# EAGLE design MG2639 Cellular Shield (EAGLE 7.1.0)
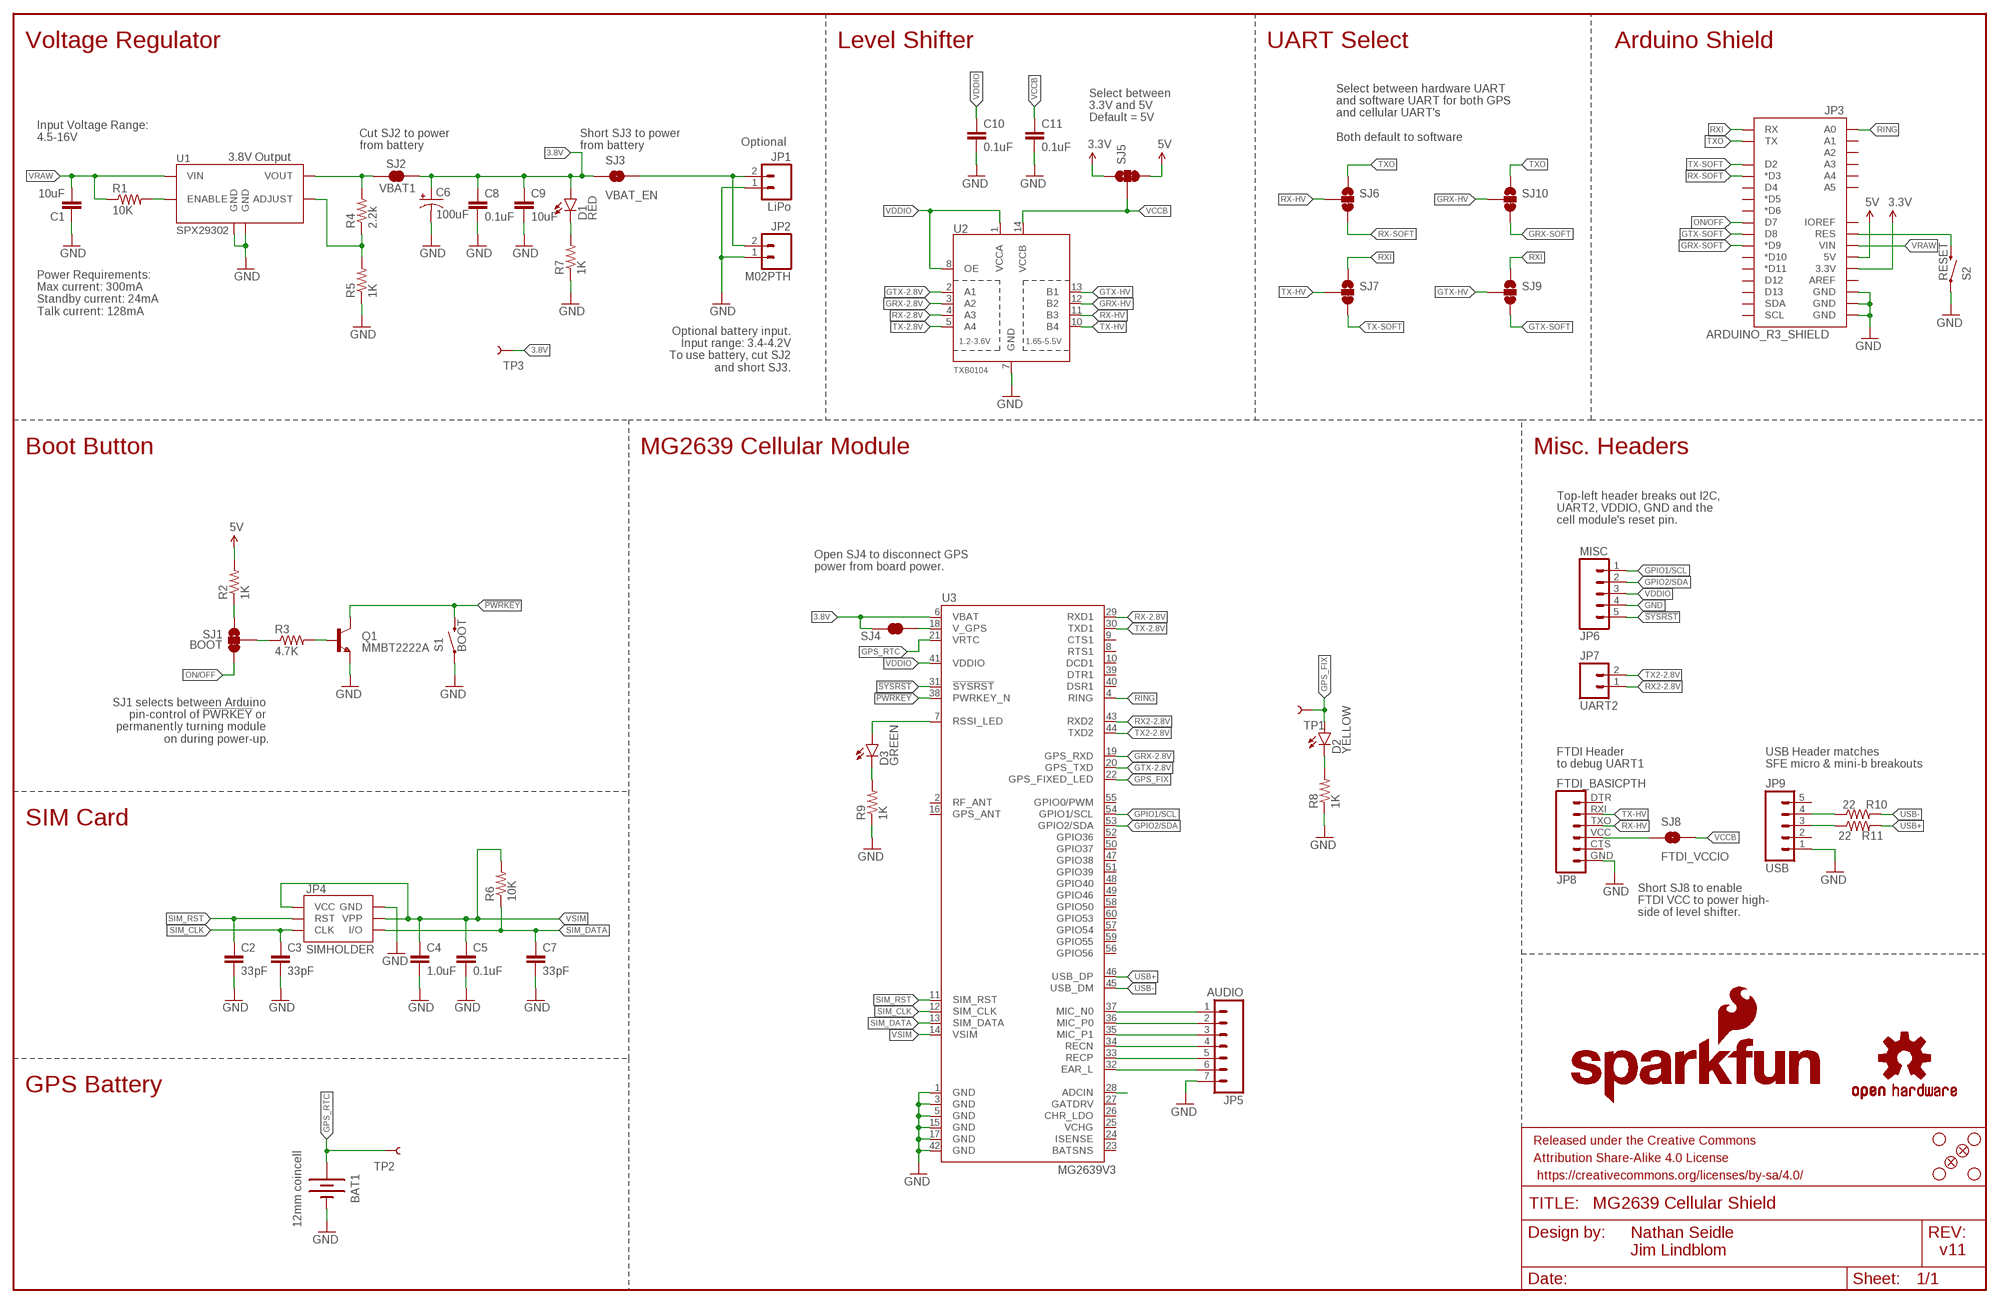
[diagram p0: schematic, sheet 1]

## Parts
BAT1  12mm coincell  BATTERY12MM  [BATTCON_12MM]
C1  10uF  10UF50V20%(1210)  [1210]
C2  33pF  33PF-50V-5%-(0603)  [0603-CAP]
C3  33pF  33PF-50V-5%-(0603)  [0603-CAP]
C4  1.0uF  1.0UF-16V-10%(0603)  [0603-CAP]
C5  0.1uF  0.1UF-25V(+80/-20%)(0603)  [0603-CAP]
C6  100uF  100UF-10V-10%(TANT)  [EIA7343]
C7  33pF  33PF-50V-5%-(0603)  [0603-CAP]
C8  0.1uF  0.1UF-25V(+80/-20%)(0603)  [0603-CAP]
C9  10uF  10UF50V20%(1210)  [1210]
C10  0.1uF  0.1UF-25V(+80/-20%)(0603)  [0603-CAP]
C11  0.1uF  0.1UF-25V(+80/-20%)(0603)  [0603-CAP]
D1  RED  LED-RED1206  [LED-1206]
D2  YELLOW  LED-YELLOWLARGE  [LED-1206]
D3  GREEN  LED-GREENLARGE  [LED-1206]
FID1  FIDUCIAL1X2  [FIDUCIAL-1X2]
FID2  FIDUCIAL1X2  [FIDUCIAL-1X2]
FRAME1  FRAME-LEDGER  [CREATIVE_COMMONS]
JP1  LiPo  M02JST-PTH-2  [JST-2-PTH]
JP2  M02PTH  [1X02]
JP3  ARDUINO_R3_SHIELD  ARDUINO_R3_SHIELDNOLABELS  [UNO_R3_SHIELD_NOLABELS]
JP4  SIMHOLDER  SIMHOLDERSIM  [SIMHOLDER]
JP5  AUDIO  M07  [1X07]
JP6  MISC  M05PTH  [1X05]
JP7  UART2  M02PTH  [1X02]
JP8  FTDI_BASICPTH  [FTDI_BASIC]
JP9  USB  M05PTH  [1X05]
LOGO1  SFE_LOGO_NAME.1_INCH  [SFE_LOGO_NAME_.1]
LOGO2  SFE_LOGO_NAME_FLAME.2_INCH  [SFE_LOGO_NAME_FLAME_.2]
LOGO3  OSHW-LOGOS  [OSHW-LOGO-S]
Q1  MMBT2222A  TRANSISTOR_NPNMMBT2222A  [SOT23-3]
R1  10K  10KOHM1/10W1%(0603)0603  [0603-RES]
R2  1K  1KOHM1/10W1%(0603)  [0603-RES]
R3  4.7K  4.7KOHM1/10W1%(0603)  [0603]
R4  2.2k  2.2KOHM1/10W1%(0603)  [0603-RES]
R5  1K  1KOHM1/10W1%(0603)  [0603-RES]
R6  10K  10KOHM1/10W1%(0603)0603  [0603-RES]
R7  1K  1KOHM1/10W1%(0603)  [0603-RES]
R8  1K  1KOHM1/10W1%(0603)  [0603-RES]
R9  1K  1KOHM1/10W1%(0603)  [0603-RES]
R10  22  22OHM1/10W1%(0603)  [0603-RES]
R11  22  22OHM1/10W1%(0603)  [0603-RES]
S1  BOOT  SWITCH-MOMENTARY-2SMD  [TACTILE-SWITCH-SMD]
S2  RESET  SWITCH-MOMENTARY-2SMD  [TACTILE-SWITCH-SMD]
SJ1  BOOT  JUMPER-PAD-3-2OF3_NC_BY_TRACE  [PAD-JUMPER-3-2OF3_NC_BY_TRACE_YES_SILK_FULL_BOX]
SJ2  VBAT1  JUMPER-PAD-2-NC_BY_TRACE  [PAD-JUMPER-2-NC_BY_TRACE_YES_SILK]
SJ3  VBAT_EN  JUMPER-PAD-2-NOYES_SILK  [PAD-JUMPER-2-NO_YES_SILK]
SJ4  JUMPER-PAD-2-NC_BY_TRACE  [PAD-JUMPER-2-NC_BY_TRACE_YES_SILK]
SJ5  JUMPER-PAD-3-2OF3_NC_BY_TRACE  [PAD-JUMPER-3-2OF3_NC_BY_TRACE_YES_SILK_FULL_BOX]
SJ6  JUMPER-PAD-3-2OF3_NC_BY_TRACE  [PAD-JUMPER-3-2OF3_NC_BY_TRACE_YES_SILK_FULL_BOX]
SJ7  JUMPER-PAD-3-2OF3_NC_BY_TRACE  [PAD-JUMPER-3-2OF3_NC_BY_TRACE_YES_SILK_FULL_BOX]
SJ8  FTDI_VCCIO  JUMPER-PAD-2-NOYES_SILK  [PAD-JUMPER-2-NO_YES_SILK]
SJ9  JUMPER-PAD-3-2OF3_NC_BY_TRACE  [PAD-JUMPER-3-2OF3_NC_BY_TRACE_YES_SILK_FULL_BOX]
SJ10  JUMPER-PAD-3-2OF3_NC_BY_TRACE  [PAD-JUMPER-3-2OF3_NC_BY_TRACE_YES_SILK_FULL_BOX]
STANDOFF1  STAND-OFF  [STAND-OFF]
STANDOFF2  STAND-OFF  [STAND-OFF]
STANDOFF3  STAND-OFF  [STAND-OFF]
STANDOFF4  STAND-OFF  [STAND-OFF]
TP1  TEST-POINT3X5  [PAD.03X.05]
TP2  TEST-POINT3X5  [PAD.03X.05]
TP3  TEST-POINT3X5  [PAD.03X.05]
U1  SPX29302  [Q5-DD_SPX29300]
U2  TXB0104  TXB0104PWRSOIC14  [SO14]
U3  MG2639V3  [MG2639]

## Nets
3.3V: JP3.3.3V SJ5.1
3.8V: C6.A(+) C8.1 C9.1 D1.A SJ2.2 SJ3.1 SJ4.1 TP3.P$1 U3.6(VBAT)
5V: JP3.5V R2.2 SJ5.3
!PWRKEY: Q1.3(C) S1.3 U3.38(PWRKEY_N)
!SYSRST: JP6.5 U3.31(!SYSRST)
ADCIN: U3.28(ADCIN)
ADJUST: R4.1 R5.2 U1.5(ADJUST)
EAR_L: JP5.6 U3.32(EAR_L)
GND: BAT1.GND(-) C1.1 C2.2 C3.2 C4.2 C5.2 C6.C(-) C7.2 C8.2 C9.2 C10.2 C11.2 JP1.1 JP2.1 JP3.GND@0(GND) JP3.GND@1(GND) JP3.GND@2(GND) JP4.C5(GND) JP5.7 JP6.4 JP8.GND JP9.1 Q1.2(E) R5.1 R7.1 R8.1 R9.1 S1.1 S2.1 U1.3(GND) U1.6(GND) U2.7(GND) U3.1(GND) U3.3(GND) U3.5(GND) U3.15(GND) U3.17(GND) U3.42(GND)
GPIO1/SCL: JP6.1 U3.54(GPIO1/SCL)
GPIO2/SDA: JP6.2 U3.53(GPIO2/SDA)
GPS_FIX: D2.A TP1.P$1 U3.22(GPS_FIXED_LED)
GPS_RTC: BAT1.PWR@1(+) TP2.P$1 U3.21(VRTC)
GRX-2.8V: U2.3(A2) U3.19(GPS_RXD)
GRX-HV: SJ10.2 U2.12(B2)
GRX-SOFT: JP3.D9(*D9) SJ10.3
GTX-2.8V: U2.2(A1) U3.20(GPS_TXD)
GTX-HV: SJ9.2 U2.13(B1)
GTX-SOFT: JP3.D8 SJ9.3
MIC_N0: JP5.1 U3.37(MIC_N0)
MIC_P0: JP5.2 U3.36(MIC_P0)
MIC_P1: JP5.3 U3.35(MIC_P1)
N$1: R1.2 U1.1(ENABLE)
N$2: JP9.4 R10.1
N$3: Q1.1(B) R3.2
N$4: R4.2 SJ2.1 U1.4(VOUT)
N$5: R3.1 SJ1.2
N$6: R2.1 SJ1.1
N$7: D3.A U3.7(RSSI_LED)
N$8: D3.C R9.2
N$9: D2.C R8.2
N$10: JP9.3 R11.1
N$11: JP8.VCC SJ8.1
N$12: JP1.2 JP2.2 SJ3.2
N$17: D1.C R7.2
ON/OFF: JP3.D7 SJ1.3
RECN: JP5.4 U3.34(RECN)
RECP: JP5.5 U3.33(RECP)
RESET: JP3.RES S2.3
RING: JP3.A0 U3.4(RING)
RX2-2.8V: JP7.1 U3.43(RXD2)
RX-2.8V: U2.4(A3) U3.29(RXD1)
RX-HV: JP8.TXO SJ6.2 U2.11(B3)
RX-SOFT: JP3.D3(*D3) SJ6.3
RXI: JP3.RX SJ7.1 SJ9.1
SIM_CLK: C3.1 JP4.C3(CLK) U3.12(SIM_CLK)
SIM_DATA: C7.1 JP4.C7(I/O) R6.1 U3.13(SIM_DATA)
SIM_RST: C2.1 JP4.C2(RST) U3.11(SIM_RST)
TX2-2.8V: JP7.2 U3.44(TXD2)
TX-2.8V: U2.5(A4) U3.30(TXD1)
TX-HV: JP8.RXI SJ7.2 U2.10(B4)
TX-SOFT: JP3.D2 SJ7.3
TXO: JP3.TX SJ6.1 SJ10.1
USB+: R11.2 U3.46(USB_DP)
USB-: R10.2 U3.45(USB_DM)
V_GPS: SJ4.2 U3.18(V_GPS)
VCCB: C11.1 SJ5.2 SJ8.2 U2.14(VCCB)
VDDIO: C10.1 JP6.3 U2.1(VCCA) U2.8(OE) U3.41(VDDIO)
VRAW: C1.2 JP3.VIN R1.1 U1.2(VIN)
VSIM: C4.1 C5.1 JP4.C1(VCC) JP4.C6(VPP) R6.2 U3.14(VSIM)
Unconnected: JP3.A1 JP3.A2 JP3.A3 JP3.A4 JP3.A5 JP3.AREF JP3.D4 JP3.D5(*D5) JP3.D6(*D6) JP3.D10(*D10) JP3.D11(*D11) JP3.D12 JP3.D13 JP3.IOREF JP3.SCL JP3.SDA JP8.CTS JP8.DTR JP9.2 JP9.5 U3.2(RF_ANT) U3.8(RTS1) U3.9(CTS1) U3.10(DCD1) U3.16(GPS_ANT) U3.23(BATSNS) U3.24(ISENSE) U3.26(CHR_LDO) U3.27(GATDRV) U3.39(DTR1) U3.40(DSR1) U3.47(GPIO38) U3.48(GPIO40) U3.49(GPIO46) U3.50(GPIO37) U3.51(GPIO39) U3.52(GPIO36) U3.55(GPIO0/PWM) U3.56(GPIO56) U3.57(GPIO54) U3.58(GPIO50) U3.59(GPIO55) U3.60(GPIO53)

## Notes on the sheet
- Voltage Regulator | Level Shifter | UART Select | Arduino Shield
- Select between
  3.3V and 5V
  Default = 5V
- Input Voltage Range:
  4.5-16V
- Select between hardware UART
  and software UART for both GPS
  and cellular UART's
  
  Both default to software
- Optional
- Cut SJ2 to power
  from battery
- Short SJ3 to power
  from battery
- 3.8V Output
- Power Requirements:
  Max current: 300mA
  Standby current: 24mA
  Talk current: 128mA
- Optional battery input.
  Input range: 3.4-4.2V
  To use battery, cut SJ2
  and short SJ3.
- Boot Button | MG2639 Cellular Module | Misc. Headers
- Top-left header breaks out I2C, 
  UART2, VDDIO, GND and the 
  cell module's reset pin.
- Open SJ4 to disconnect GPS 
  power from board power.
- SJ1 selects between Arduino 
  pin-control of !PWRKEY! or 
  permanently turning module 
  on during power-up.
- FTDI Header
  to debug UART1
- USB Header matches
  SFE micro & mini-b breakouts
- SIM Card
- Short SJ8 to enable 
  FTDI VCC to power high-
  side of level shifter.
- GPS Battery
- Nathan Seidle
  Jim Lindblom
- v11

## Power pins joined to a net without a drawn wire
VCHG: U3.25(VCHG)

## Library data of the parts
BAT1 = SparkFun-Electromechanical:BATTERY: Battery Holders Various common sizes : AA, AAA, 20mm coin cell and 12mm coin cell. 20MM_4LEGS, BATT-10373; PROD_ID: BATT-08044
C1 C9 = SparkFun-Capacitors:10UF50V20%(1210): CAP-09824; PROD_ID: CAP-09824
C2 C3 C7 = SparkFun-Capacitors:33PF-50V-5%-(0603): CAP-10142; PROD_ID: CAP-10142
C4 = SparkFun-Capacitors:1.0UF-16V-10%(0603): CAP-00868; PROD_ID: CAP-00868
C5 C8 C10 C11 = SparkFun-Capacitors:0.1UF-25V(+80/-20%)(0603): CAP-00810 Ceramic Standard decoupling cap; PROD_ID: CAP-00810
C6 = SparkFun-Capacitors:100UF-10V-10%(TANT): CAP-07890; PROD_ID: CAP-07890
D1 = SparkFun-LED:LED-RED: Assorted Red LEDs LilyPad 1206- DIO-09912 1206- DIO-00809 0603- DIO-00819; PROD_ID: DIO-00809
D2 = SparkFun-LED:LED-YELLOW: Yellow SMD LEDs LilyPad 1206- DIO-09909 0603- DIO-09003; PROD_ID: DIO-00820
D3 = SparkFun-LED:LED-GREEN: Various green LEDs Green LEDs used in SFE Production 0603- DIO-00821 LARGE- DIO-00862 LILYPAD- DIO-09910; PROD_ID: DIO-00862
FID1 FID2 = SparkFun-Aesthetics:FIDUCIAL: Fiducial Alignment Points Various fiducial points for machine vision alignment.
FRAME1 = SparkFun-Aesthetics:FRAME-LEDGER: Schematic Frame Standard 11x14 US Ledger frame
JP1 = SparkFun-Connectors:M02: Standard 2-pin 0.1" header. Use with - straight break away headers ( PRT-00116) - right angle break away headers (PRT-00553) - swiss pins (PRT-00743) - machine pins (PRT-00117) - female headers (PRT-00115) Molex polarized connector foot print use with: PRT-08233 with associated crimp pins and housings. 2.54_SCREWTERM for use with PRT-10571. 3.5mm Screw Terminal footprints for PRT-08084 5mm Screw Terminal footprints for use with PRT-08432; PROD_ID: CONN-09863; SKU: PRT-09914
JP2 JP7 = SparkFun-Connectors:M02: Standard 2-pin 0.1" header. Use with - straight break away headers ( PRT-00116) - right angle break away headers (PRT-00553) - swiss pins (PRT-00743) - machine pins (PRT-00117) - female headers (PRT-00115) Molex polarized connector foot print use with: PRT-08233 with associated crimp pins and housings. 2.54_SCREWTERM for use with PRT-10571. 3.5mm Screw Terminal footprints for PRT-08084 5mm Screw Terminal footprints for use with PRT-08432
JP3 = SparkFun-Boards:ARDUINO_R3_SHIELD: Shield form compatible with the Arduino Uno R3.
JP4 = SparkFun-Connectors:SIMHOLDER: SIM Socket Socket for SIM cellular cards. Schematic element and footprint production proven. Spark Fun Electronics SKU : PRT-00548; PROD_ID: CONN-08536
JP5 = SparkFun-Connectors:M07: Header 7 Standard 7-pin 0.1" header. Use with straight break away headers (SKU : PRT-00116), right angle break away headers (PRT-00553), swiss pins (PRT-00743), machine pins (PRT-00117), and female headers (PRT-00115). NOTES ON THE VARIANTS LOCK and LOCK_LONGPADS... This footprint was designed to help hold the alignment of a through-hole component (i.e. 7-pin header) while soldering it into place. You may notice that each hole has been shifted either up or down by 0.005 of an inch from it's more standard position (which is usually a perfectly straight line). This slight alteration caused the pins (the squares in the middle) to touch the edges of the holes. Because they are alternating, it causes a "brace" to hold the header in place. 0.005 has proven to be the perfect amount of "off-center" position when using our standard breakaway headers. Although looks a little odd when you look at the bare footprint, once you have a header in there, the alteration is very hard to notice. Also, if you push a header all the way into place, it is covered up entirely on the bottom side. This idea of altering the position of holes to aid alignment will be further integrated into the Sparkfun Library for other footprints. It can help hold any component with 3 or more connection pins.
JP6 JP9 = SparkFun-Connectors:M05: Header 5 Standard 5-pin 0.1" header. Use with straight break away headers (SKU : PRT-00116), right angle break away headers (PRT-00553), swiss pins (PRT-00743), machine pins (PRT-00117), and female headers (PRT-00115). Molex polarized connector foot print use with SKU : PRT-08230 with associated crimp pins and housings.
JP8 = SparkFun-Connectors:FTDI_BASIC: FTDI Basic header with labels
LOGO1 = SparkFun-Aesthetics:SFE_LOGO_NAME: SFE Logo, name only This is the SparkFun name logo. The logo on the schematic will always be the same size; the package variant is the height of the flame part of the logo (or the height the flame would be, if it were drawn). Default layer for the logo on the board is tSilk.
LOGO2 = SparkFun-Aesthetics:SFE_LOGO_NAME_FLAME: SFE Logo, name and flame This is the SparkFun full logo. The logo on the schematic will always be the same size; the package variant is the height of the flame part of the logo. Default layer for the logo on the board is tSilk.
LOGO3 = SparkFun-Aesthetics:OSHW-LOGO: Open Source Hardware Logo This logo indicates the piece of hardware it is found on incorporates a OSHW license and/or adheres to the definition of open source hardware found here: http://freedomdefined.org/OSHW
Q1 = SparkFun-DiscreteSemi:TRANSISTOR_NPN: Generic NPN BJT MMBT2222A - TRANS-08049 (SOT-23, 1A 40V) MPSA42 - TRANS-09116 (SOT-23, 500mA 300V) MMBT5088LT1G - TRANS-11160 (SOT-23, 50 mA 30V) BC547 - COM-08928 <http://www.sparkfun.com/products/8928> (TO-92 45V 100mA) (1.Collector 2.Base 3.Emitter) 2N3904 - COM-00521 <http://www.sparkfun.com/products/521> (TO-92 40V 200mA) (1.Emitter 2.Base 3.Collector) P2N2222A - COM-12852 <http://www.sparkfun.com/products/12852> (TO-92 40V 600mA) (1.Collector 2.Base 3.Emitter); PROD_ID: TRANS-08049
R1 R6 = SparkFun-Resistors:10KOHM1/10W1%(0603): RES-00824; PROD_ID: RES-00824
R2 R5 R7-R9 = SparkFun-Resistors:1KOHM1/10W1%(0603): RES-07856; PROD_ID: RES-07856
R3 = SparkFun-Resistors:4.7KOHM1/10W1%(0603): RES-07857; PROD_ID: RES-07857
R4 = SparkFun-Resistors:2.2KOHM1/10W1%(0603): RES-08272; PROD_ID: RES-08272
R10 R11 = SparkFun-Resistors:22OHM1/10W1%(0603): RES-08698; PROD_ID: RES-08698
S1 S2 = SparkFun-Electromechanical:SWITCH-MOMENTARY-2: Various NO switches- pushbuttons, reed, etc; PROD_ID: SWCH-08247
SJ1 SJ5-SJ7 SJ9 SJ10 = SparkFun-Passives:JUMPER-PAD-3-2OF3_NC_BY_TRACE
SJ2 SJ4 = SparkFun-Passives:JUMPER-PAD-2-NC_BY_TRACE
SJ3 SJ8 = SparkFun-Passives:JUMPER-PAD-2-NO
STANDOFF1-STANDOFF4 = SparkFun-Electromechanical:STAND-OFF: #4 Stand Off This is the mechanical footprint for a #4 phillips button head screw. Use the keepout ring to avoid running the screw head into surrounding components. SKU : PRT-00447
TP1-TP3 = SparkFun-Passives:TEST-POINT: Bare copper test points for troubleshooting or ICT
U1 = SparkFun-PowerIC:SPX29302: 3A LDO regulator; PROD_ID: VREG-08337
U2 = SparkFun-DigitalIC:TXB0104PWR: 4-Bit Bi-Directional Level Shifter 1.2V-3.6V (VCCA) to 1.65V-5.5V (VCCB) bi-directional level shifter with auto direction sensing. Max data rate - VCCA 1.8V: 20Mbps (50ns), VCCA 3.3V: 100Mbps (10ns) Digikey: 296-21929-1-ND (TSSOP) IC-11329; PROD_ID: IC-11329
U3 = MG2639:MG2639; PROD_ID: GPS-12331

## Net classes
0 default: width 0.203 mm
1 3.8V: width 0.305 mm

## Board
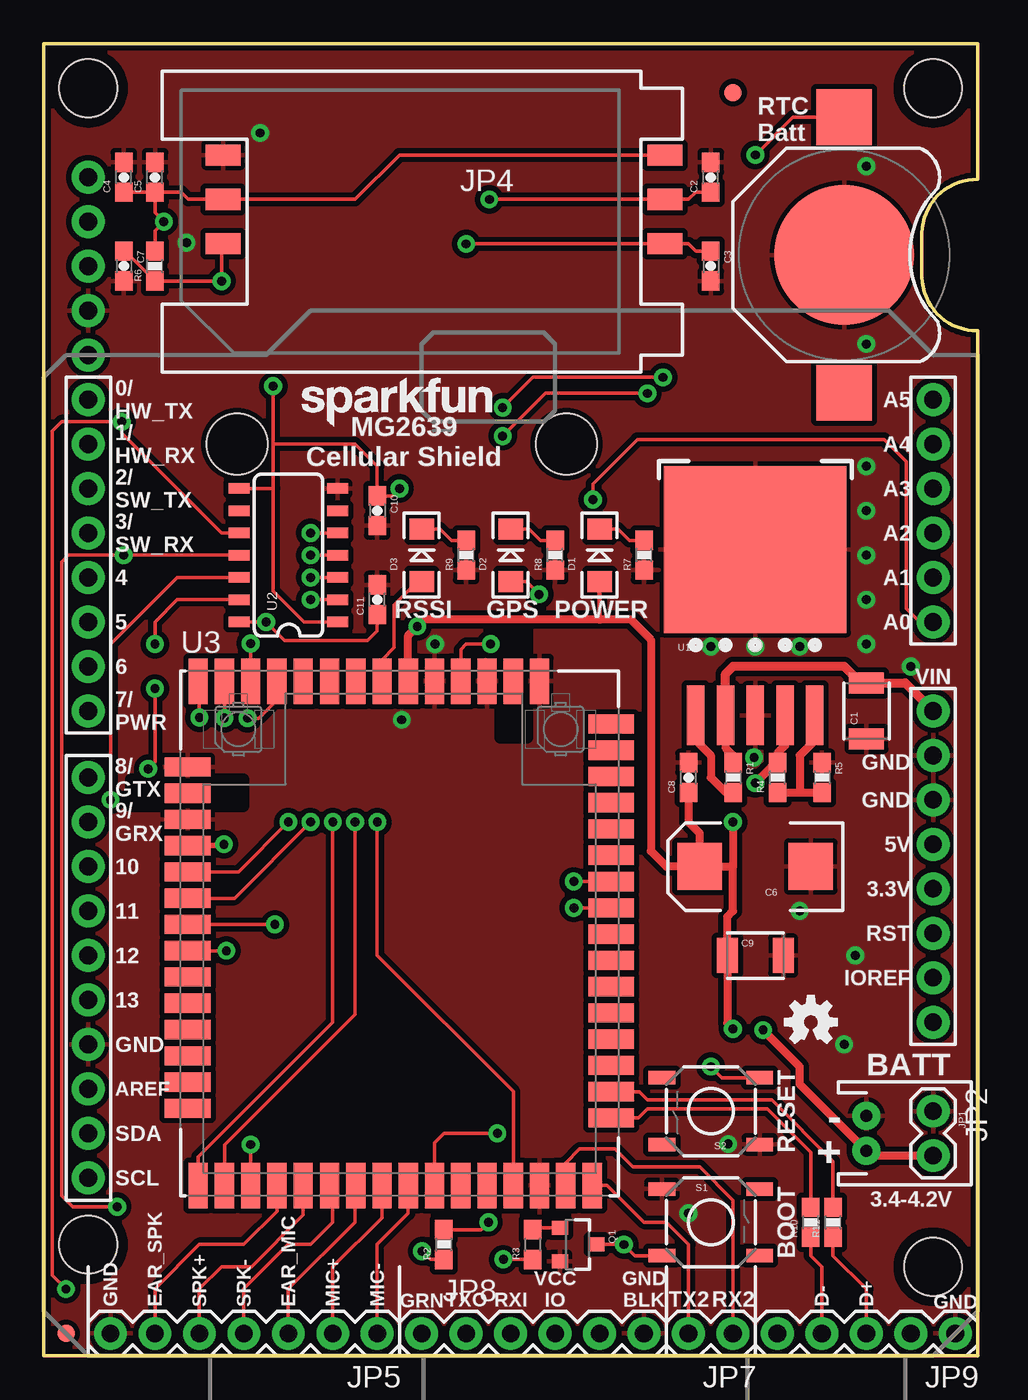
[diagram p1: board, top side]
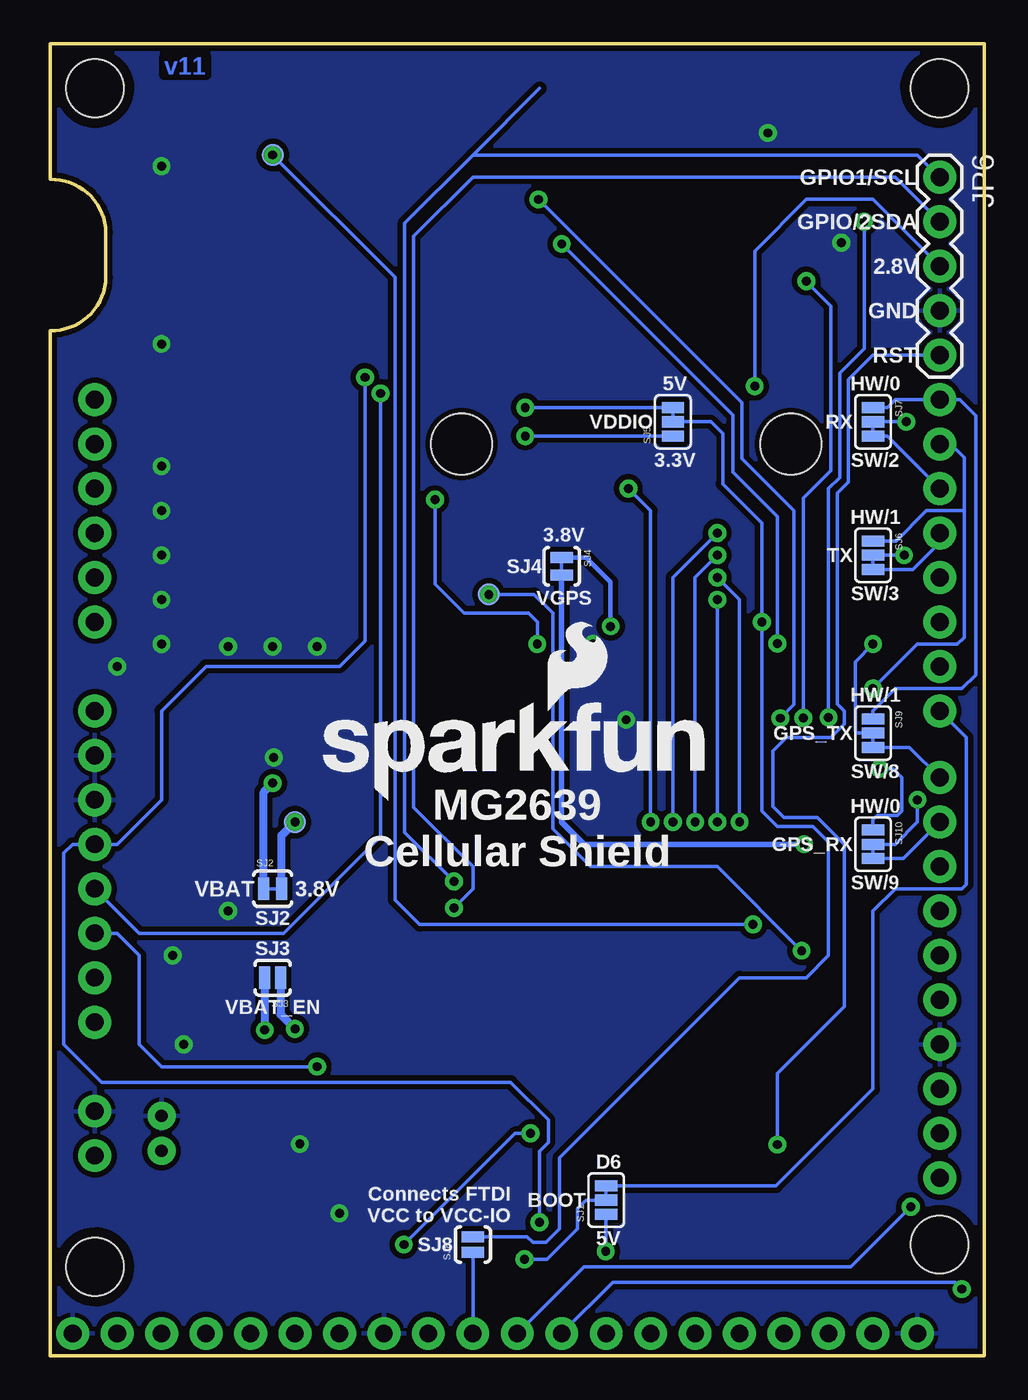
[diagram p2: board, bottom side, seen from below]

Size 53.34 x 74.93 mm. Coordinates in mm from the lower left corner, seen from the top.
Outline: 0,0 53.34,0 53.34,58.55 arc-90 50.16,61.59 50.16,64.14 arc-90 53.34,67.18 53.34,74.93 0,74.93 0,0
Copper layers (1*16): Top 0.035mm / dielectric 1.5mm / Bottom 0.035mm
Design rules "SparkFun-2-layer *": minimum track width 7mil, minimum drill 15mil, track to track 7mil, track to pad 7mil, pad to pad 7mil, via to via 7mil, smd to smd 7mil, copper to edge 8mil, drill to drill 8mil, minimum pad ring 12mil, minimum via ring 10mil, stop-mask expansion 4mil, vias tented up to drill 20mil, thermal gap 10mil
Holes 3.5 mm at 29.84,52.07 11.05,52.07
tRestrict: area 9.6,31.4 to 11.4,32.9; area 5,31.4 to 6.8,32.9; area 26.1,35.3 to 27.6,37.1; area 26.1,39.9 to 27.6,41.7

### Footprints (pad centres in the part's own frame; a part is rotated, then mirrored left to right if it is on the bottom)
BATTCON_12MM = smd 8 x 8: GND 0,0 | smd 3.175 x 3.175: PWR@1 -7.874,0; PWR@2 7.874,0
1210 = smd 1.2 x 2: 1 -1.6,0; 2 1.6,0
0603-CAP = smd 1.1 x 1: 1 -0.85,0; 2 0.85,0
EIA7343 = smd 2.55 x 2.7: A 3.17,0; C -3.17,0
LED-1206 = smd 1.2 x 1.4: A -1.5,0; C 1.5,0
FIDUCIAL-1X2 = smd 1 x 1: 1 0,0
JST-2-PTH = drill 0.7 pad 1.6: 1 -1,0; 2 1,0
1X02 = drill 1.016 pad 1.88: 1 0,0; 2 2.54,0
UNO_R3_SHIELD_NOLABELS = drill 1.016 pad 1.88: 3.3V 50.8,26.67; 5V 50.8,29.21; A0 50.8,41.91; A1 50.8,44.45; A2 50.8,46.99; A3 50.8,49.53; A4 50.8,52.07; A5 50.8,54.61; AREF 2.54,15.24; D2 2.54,49.53; D3 2.54,46.99; D4 2.54,44.45; D5 2.54,41.91; D6 2.54,39.37; D7 2.54,36.83; D8 2.54,33.02; D9 2.54,30.48; D10 2.54,27.94; D11 2.54,25.4; D12 2.54,22.86; D13 2.54,20.32; GND@0 50.8,31.75; GND@1 50.8,34.29; GND@2 2.54,17.78; IOREF 50.8,21.59; NC 50.8,19.05; RES 50.8,24.13; RX 2.54,54.61; SCL 2.54,10.16; SDA 2.54,12.7; TX 2.54,52.07; VIN 50.8,36.83
SIMHOLDER = smd 2 x 1.2: C1 -12.61,-3.81; C2 -12.61,-1.27; C3 -12.61,1.27; C5 12.61,-3.81; C6 12.61,-1.27; C7 12.61,1.27
1X07 = drill 1.016 pad 1.88: 1 0,0; 2 2.54,0; 3 5.08,0; 4 7.62,0; 5 10.16,0; 6 12.7,0; 7 15.24,0
1X05 = drill 1.016 pad 1.88: 1 0,0; 2 2.54,0; 3 5.08,0; 4 7.62,0; 5 10.16,0
FTDI_BASIC = drill 1.016 pad 1.88: CTS 10.16,0; DTR 0,0; GND 12.7,0; RXI 2.54,0; TXO 5.08,0; VCC 7.62,0
SOT23-3 = smd 0.8 x 0.9: 1 -0.95,-1; 2 0.95,-1; 3 0,1.1
0603-RES = smd 1.1 x 1: 1 -0.85,0; 2 0.85,0
0603 = smd 1.1 x 1: 1 -0.85,0; 2 0.85,0
TACTILE-SWITCH-SMD = smd 1.524 x 0.762: 1 -2.794,1.905; 2 2.794,1.905; 3 -2.794,-1.905; 4 2.794,-1.905
PAD-JUMPER-3-2OF3_NC_BY_TRACE_YES_SILK_FULL_BOX = smd 0.635 x 1.27: 1 -0.813,0; 2 0,0; 3 0.813,0
PAD-JUMPER-2-NC_BY_TRACE_YES_SILK = smd 0.635 x 1.27: 1 -0.508,0; 2 0.508,0
PAD-JUMPER-2-NO_YES_SILK = smd 0.635 x 1.27: 1 -0.45,0; 2 0.45,0
STAND-OFF = hole 3.302: 0,0
PAD.03X.05 = smd 1.27 x 1.27: P$1 0,0
Q5-DD_SPX29300 = smd 1 x 3.4: 1 -3.4,-7.875; 2 -1.7,-7.875; 3 0,-7.875; 4 1.7,-7.875; 5 3.4,-7.875 | smd 10.414 x 9.525: 6 0,1.595
SO14 = smd 0.6 x 1.2: 1 -3.81,-2.8; 2 -2.54,-2.8; 3 -1.27,-2.8; 4 0,-2.8; 5 1.27,-2.8; 6 2.54,-2.8; 7 3.81,-2.8; 8 3.81,2.8; 9 2.54,2.8; 10 1.27,2.8; 11 0,2.8; 12 -1.27,2.8; 13 -2.54,2.8; 14 -3.81,2.8
MG2639 = smd 1.1 x 2.6: 1 8,14.4; 2 6.5,14.4; 3 5,14.4; 4 3.5,14.4; 5 2,14.4; 6 0.5,14.4; 7 -1,14.4; 8 -2.5,14.4; 9 -4,14.4; 10 -5.5,14.4; 11 -7,14.4; 12 -8.5,14.4; 13 -10,14.4; 14 -11.5,14.4; 29 -11.5,-14.4; 30 -10,-14.4; 31 -8.5,-14.4; 32 -7,-14.4; 33 -5.5,-14.4; 34 -4,-14.4; 35 -2.5,-14.4; 36 -1,-14.4; 37 0.5,-14.4; 38 2,-14.4; 39 3.5,-14.4; 40 5,-14.4; 41 6.5,-14.4; 42 8,-14.4; 43 9.5,-14.4; 44 11,-14.4 | smd 2.6 x 1.1: 15 -12.1,9.5; 16 -12.1,8; 17 -12.1,6.5; 18 -12.1,5; 19 -12.1,3.5; 20 -12.1,2; 21 -12.1,0.5; 22 -12.1,-1; 23 -12.1,-2.5; 24 -12.1,-4; 25 -12.1,-5.5; 26 -12.1,-7; 27 -12.1,-8.5; 28 -12.1,-10; 45 12.1,-10.55; 46 12.1,-9.05; 47 12.1,-7.55; 48 12.1,-6.05; 49 12.1,-4.55; 50 12.1,-3.05; 51 12.1,-1.55; 52 12.1,-0.05; 53 12.1,1.45; 54 12.1,2.95; 55 12.1,4.45; 56 12.1,5.95; 57 12.1,7.45; 58 12.1,8.95; 59 12.1,10.45; 60 12.1,11.95

### Placement (x,y rotation side)
BAT1  45.72,62.87 270 top
C1  46.99,36.83 90 top
C2  38.1,67.31 90 top
C3  38.1,62.23 270 top
C4  4.57,67.31 90 top
C5  6.35,67.31 90 top
C6  40.64,27.94 180 top
C7  4.57,62.23 270 top
C8  36.83,33.02 90 top
C9  40.64,22.86 0 top
C10  19.05,48.26 270 top
C11  19.05,43.18 90 top
D1  31.75,45.72 90 top
D2  26.67,45.72 90 top
D3  21.59,45.72 90 top
FID1  1.27,1.27 0 top
FID2  39.37,72.14 0 top
FRAME1  -7.62,-22.86 0 top  (outside the outline)
JP1  46.99,12.7 270 top
JP2  50.8,13.97 270 top
JP3  0,0 0 top
JP4  22.86,64.77 180 top
JP5  19.05,1.27 180 top
JP6  2.54,67.31 270 bottom
JP7  39.37,1.27 180 top
JP8  21.59,1.27 0 top
JP9  52.07,1.27 180 top
LOGO1  14.22,52.55 0 top
LOGO2  38.48,31.62 0 bottom
LOGO3  43.81,19.05 0 top
Q1  30.48,6.35 270 top
R1  39.37,33.02 270 top
R2  22.86,6.35 90 top
R3  27.94,6.35 90 top
R4  41.91,33.02 90 top
R5  44.45,33.02 270 top
R6  6.35,62.23 90 top
R7  34.29,45.72 90 top
R8  29.21,45.72 90 top
R9  24.13,45.72 90 top
R10  43.81,7.62 90 top
R11  45.09,7.62 90 top
S1  38.1,7.62 0 top
S2  38.1,13.97 180 top
SJ1  21.59,8.89 90 bottom
SJ2  40.64,26.67 0 bottom
SJ3  40.64,21.59 180 bottom
SJ4  24.13,45.09 270 bottom
SJ5  17.78,53.34 90 bottom
SJ6  6.35,45.72 270 bottom
SJ7  6.35,53.34 270 bottom
SJ8  29.21,6.35 90 bottom
SJ9  6.35,35.56 270 bottom
SJ10  6.35,29.21 270 bottom
STANDOFF1  50.8,72.39 90 top
STANDOFF2  2.54,72.39 90 top
STANDOFF3  2.54,6.35 0 top
STANDOFF4  50.8,5.08 0 top
TP1  28.3,43.48 0 bottom
TP2  40.64,68.58 0 bottom
TP3  39.37,30.48 0 bottom
U1  40.64,44.45 0 top
U2  13.97,45.72 90 top
U3  20.32,24.13 0 top

### Tracks (layer width: path | path; a pad name or v marks a point on that pad's centre or on a via)
3.3V  (via drill 0.51)
  Top 0.203: v26.21,52.53 28.65,54.97 v34.48,54.97
  Bottom 0.203: JP3.3.3V 48.26,24.13 40.01,24.13 34.48,29.65 v34.48,54.97 | SJ5.1 v26.21,52.53
3.8V  (via drill 0.51)
  Top 0.254: D1.A 31.75,42.04
  Top 0.457: U3.6 20.82,41.14 v21.34,41.66 21.72,42.04 31.75,42.04 33.53,42.04 34.67,40.89 34.67,28.83 35.56,27.94 C6.A | C6.A | C6.A 39.37,27.94 | 39.37,27.94 39.37,25.4 39.04,25.07 C9.1 39.04,19 v39.37,18.67 | C8.1 36.83,30.48 37.47,29.84 C6.A | TP3.P$1 39.37,27.94
  Bottom 0.254: SJ4.1 22.73,45.59 21.34,44.2 v21.34,41.66
  Bottom 0.457: SJ2.2 40.13,29.72 TP3.P$1 | SJ3.1 40.19,19.49 v39.37,18.67
  other vias: 39.37,30.48
5V  (via drill 0.51)
  Top 0.203: R2.2 24.98,7.2 v25.4,7.62 | v26.21,54.15 27.94,55.88 v35.37,55.88
  Bottom 0.203: v35.37,55.88 35.37,40.83 36.83,39.37 44.45,39.37 46.99,36.83 46.99,31.75 49.53,29.21 JP3.5V 52.07,29.21 52.58,28.7 52.58,17.78 50.42,15.62 27.05,15.62 24.89,13.46 24.89,12.19 25.4,11.68 v25.4,7.62 | SJ5.3 v26.21,54.15
!PWRKEY  (via drill 0.51)
  Top 0.203: Q1.3 v33.15,6.35 33.78,5.71 S1.3 | U3.38 22.32,12.16 22.86,12.7 v25.91,12.7
  Bottom 0.203: v25.91,12.7 26.8,12.7 v33.15,6.35
!SYSRST  (via drill 0.51)
  Top 0.203: U3.31 v11.82,12.06
  Bottom 0.203: v11.82,12.06 11.82,16.12 8,19.94 8,29.21 9.53,30.73 11.43,30.73 12.06,31.37 12.06,34.54 11.3,35.31 8.76,35.31 8,36.07 8,36.83 8.38,37.21 8.38,49.28 7.75,49.91 7.75,55.75 6.35,57.15 JP6.5
ADJUST
  Top 0.457: U1.5 44.04,35.15 43.18,34.29 43.18,32.17 | 43.18,32.17 R5.2 | R4.1 43.18,32.17
EAR_L
  Top 0.203: U3.32 13.32,8.24 11.43,6.35 8.89,6.35 6.35,3.81 JP5.6
GND  (via drill 0.51)
  other vias: 46.99,57.78 46.99,67.94 49.53,39.37 40.58,34.16 43.18,25.4 46.35,22.86 45.72,17.78 20.45,36.32 22.35,40.64 12.36,69.84 46.99,50.8 46.99,48.26 46.99,45.72 46.99,43.18 46.99,40.64 40.64,40.51 38.1,40.51 43.18,40.51 8.15,63.58 36.83,8.13 39.09,12.09
  pour Top (isolate 0.305): 0,0 0,74.93 53.34,74.93 53.34,0
  pour Bottom (isolate 0.305): 0,0 0,74.93 53.34,74.93 53.34,0
GPIO1/SCL  (via drill 0.51)
  Top 0.203: U3.54 v30.28,27.08
  Bottom 0.203: v30.28,27.08 33.1,29.9 33.1,64.69 29.21,68.58 | 29.21,68.58 25.4,72.39 | JP6.1 3.81,68.58 29.21,68.58
GPIO2/SDA  (via drill 0.51)
  Top 0.203: U3.53 v30.28,25.58
  Bottom 0.203: v30.28,25.58 29.21,26.65 29.21,27.94 32.59,31.32 32.59,63.93 29.21,67.31 5.08,67.31 JP6.2
GPS_FIX  (via drill 0.51)
  Top 0.203: U3.22 v10.43,23.13 | D2.A 27.56,44.22 TP1.P$1
  Bottom 0.203: v10.43,23.13 15.24,27.94 22.48,27.94 24.64,30.1 24.64,42.42 25.7,43.48 TP1.P$1
  other vias: 28.3,43.48
GPS_RTC  (via drill 0.51)
  Top 0.203: U3.21 v13.2,24.63 | BAT1.PWR@1 42.8,70.74 TP2.P$1
  Bottom 0.203: v13.2,24.63 32.25,24.63 33.66,26.04 33.66,61.59 TP2.P$1
  other vias: 40.64,68.58
GRX-2.8V  (via drill 0.51)
  Top 0.203: U2.3 v15.24,44.45 | v13.97,30.48 11.12,27.63 U3.19
  Bottom 0.203: v15.24,44.45 13.97,43.18 v13.97,30.48
GRX-HV  (via drill 0.51)
  Top 0.203: U2.12 7.62,44.45 3.81,40.64 v3.81,31.75
  Bottom 0.203: SJ10.2 5.08,29.21 3.81,30.48 v3.81,31.75
GRX-SOFT
  Bottom 0.203: SJ10.3 4.62,28.4 JP3.D9
GTX-2.8V  (via drill 0.51)
  Top 0.203: U3.20 10.89,26.13 v15.24,30.48 | U2.2 v15.24,43.18
  Bottom 0.203: v15.24,43.18 v15.24,30.48
GTX-HV  (via drill 0.51)
  Top 0.203: U2.13 7.62,43.18 6.35,41.91 v6.35,40.64
  Bottom 0.203: SJ9.2 7.24,35.56 7.37,35.69 7.37,39.62 v6.35,40.64
GTX-SOFT
  Bottom 0.203: SJ9.3 4.27,34.75 JP3.D8
MIC_N0
  Top 0.203: U3.37 20.82,8.12 19.05,6.35 JP5.1
MIC_P0
  Top 0.203: JP5.2 16.51,5.08 19.32,7.89 U3.36
MIC_P1
  Top 0.203: JP5.3 13.97,3.81 17.78,7.62 17.78,8.89 17.82,8.93 U3.35
N$1
  Top 0.457: U1.1 37.24,35.15 38.1,34.29 38.1,33.02 38.95,32.17 R1.2
N$2
  Top 0.203: R10.1 43.81,5.71 44.45,5.08 JP9.4
N$3
  Top 0.203: Q1.1 28.04,7.3 R3.2
N$4  (via drill 0.51)
  Top 0.457: U1.4 42.34,34.85 41.91,34.42 R4.2 41.81,33.87 v40.64,32.7
  Bottom 0.457: v40.64,32.7 41.15,32.19 SJ2.1
N$5  (via drill 0.51)
  Top 0.203: R3.1 v26.25,5.5
  Bottom 0.203: SJ1.2 22.73,8.89 23.24,8.38 23.24,7.24 24.98,5.5 v26.25,5.5
N$6  (via drill 0.51)
  Top 0.203: R2.1 22.08,5.5 v21.61,5.97
  Bottom 0.203: SJ1.1 21.59,5.99 v21.61,5.97
N$7
  Top 0.203: U3.7 19.32,39.74 20.02,40.44 20.02,42.88 21.36,44.22 D3.A
N$8
  Top 0.203: D3.C 22.63,47.22 23.28,46.57 R9.2
N$9
  Top 0.203: D2.C 27.71,47.22 28.36,46.57 R8.2
N$10
  Top 0.203: R11.1 45.09,5.71 46.99,3.81 JP9.3
N$11
  Bottom 0.203: JP8.VCC SJ8.1
N$12  (via drill 0.51)
  Top 0.457: JP2.2 47.26,11.43 JP1.2 43.18,15.51 43.18,16.51 v41.09,18.6
  Bottom 0.457: SJ3.2 v41.09,18.6
N$17
  Top 0.203: D1.C 32.79,47.22 33.44,46.57 R7.2
ON/OFF
  Bottom 0.203: SJ1.3 11.89,9.7 6.35,15.24 6.35,25.4 5.08,26.67 1.27,26.67 1.02,26.92 1.02,35.31 JP3.D7
RECN
  Top 0.203: JP5.4 11.43,3.81 13.97,6.35 15.24,6.35 16.51,7.62 16.51,8.89 16.32,9.08 U3.34
RECP
  Top 0.203: U3.33 14.82,8.04 11.86,5.08 10.16,5.08 8.89,3.81 JP5.5
RESET  (via drill 0.51)
  Top 0.203: S2.3 38.73,15.88 v38.1,16.51
  Bottom 0.203: JP3.RES 49.53,24.13 48.26,22.86 48.26,17.78 46.99,16.51 v38.1,16.51
RING  (via drill 0.51)
  Top 0.203: U3.4 23.82,40.33 24.13,40.64 v25.53,40.64 | JP3.A0 50.04,41.91 49.28,42.67 49.28,51.05 48.01,52.32 33.91,52.32 31.37,49.78 v31.37,48.9
  Bottom 0.203: v31.37,48.9 31.37,44.07 29.72,42.42 26.04,42.42 25.53,41.91 v25.53,40.64
RX2-2.8V
  Top 0.203: U3.43 29.82,11.02 30.61,11.81 32.64,11.81 33.66,10.79 37.47,10.79 39.37,8.89 JP7.1
RX-2.8V  (via drill 0.51)
  Top 0.203: U3.29 8.82,11.36 16.51,19.05 v16.51,30.48 | U2.4 v15.24,45.72
  Bottom 0.203: v16.51,30.48 16.51,44.45 v15.24,45.72
RX-HV  (via drill 0.51)
  Top 0.203: U2.11 v4.57,45.72 1.4,45.72 1.02,45.34 1.02,9.14 1.65,8.51 v4.19,8.51
  Bottom 0.203: v4.57,45.72 SJ6.2 | JP8.TXO 22.86,5.08 7.62,5.08 v4.19,8.51
RX-SOFT
  Bottom 0.203: SJ6.3 4.06,44.91 2.54,46.43 JP3.D3
RXI
  Bottom 0.203: SJ7.1 5.54,54.15 5.08,54.61 JP3.RX 1.4,54.61 0.48,53.7 0.48,38.89 1.27,38.1 5.08,38.1 6.35,36.83 SJ9.1
SIM_CLK  (via drill 0.51)
  Top 0.203: C3.1 37.25,63.08 36.83,63.5 JP4.C3 v24.13,63.5 | U3.12 v11.82,40.68
  Bottom 0.203: v24.13,63.5 14.35,53.72 14.35,50.47 11.82,47.94 v11.82,40.68
SIM_DATA  (via drill 0.51)
  Top 0.203: JP4.C7 10.16,63.5 10.16,61.47 | 10.16,61.47 v10.16,61.38 | v10.32,36.42 U3.13 | C7.1 4.65,63.08 R6.1 10.07,61.38 10.16,61.47
  Bottom 0.203: v10.32,36.42 10.32,48.99 8.76,50.55 8.76,59.94 10.16,61.34 v10.16,61.38
SIM_RST  (via drill 0.51)
  Top 0.203: C2.1 37.25,66.46 36.83,66.04 JP4.C2 v25.45,66.04 | v11.64,36.41 12.28,36.41 13.32,37.45 U3.11
  Bottom 0.203: v25.45,66.04 13.84,54.43 13.84,51.23 10.87,48.26 10.87,37.18 v11.64,36.41
TX2-2.8V
  Top 0.203: U3.44 32.18,9.73 34.29,7.62 35.56,7.62 36.83,6.35 JP7.2
TX-2.8V  (via drill 0.51)
  Top 0.203: U3.30 10.32,12.05 17.78,19.51 v17.78,30.48 | v15.24,46.99 U2.5
  Bottom 0.203: v17.78,30.48 17.78,44.45 v15.24,46.99
TX-HV  (via drill 0.51)
  Top 0.203: U2.10 10.16,46.99 4.45,52.7 v4.45,53.34 1.02,53.34 0.48,52.81 0.48,4.6 v1.27,3.81
  Bottom 0.203: SJ7.2 v4.45,53.34 | JP8.RXI 21.21,4.19 1.65,4.19 v1.27,3.81
TX-SOFT
  Bottom 0.203: JP3.D2 5.54,52.53 SJ7.3
TXO  (via drill 0.51)
  Top 0.203: v6.35,38.1 6.35,33.9 v5.97,33.52
  Bottom 0.203: JP3.TX 1.91,52.07 1.14,51.31 1.14,48.26 | 1.14,48.26 3.3,48.26 5.03,46.53 SJ6.1 | 1.14,48.26 1.14,41.02 1.52,40.64 3.81,40.64 v6.35,38.1 | SJ10.1 6.35,30.61 6.1,30.86 4.95,30.86 4.7,31.11 4.7,33.02 4.89,33.21 5.08,33.4 5.2,33.52 v5.97,33.52
USB+
  Top 0.203: U3.46 34.02,15.08 34.49,14.61 41.59,14.61 45.09,11.11 R11.2
USB-
  Top 0.203: R10.2 43.81,11.62 41.34,14.1 34.49,14.1 33.98,13.58 U3.45
V_GPS  (via drill 0.51)
  Top 0.305: U3.18 10.21,29.13 v10.29,29.21
  Bottom 0.305: SJ4.2 24.13,30.48 22.86,29.21 v10.29,29.21
VCCB  (via drill 0.51)
  Top 0.203: U2.14 v12.7,41.91 13.77,40.84 18.49,40.84 19.05,41.4 C11.1
  Bottom 0.203: SJ5.2 15.62,53.34 14.94,52.65 14.94,49.78 12.7,47.55 v12.7,41.91 12.7,31.11 11.81,30.23 9.78,30.23 8.89,29.34 8.89,22.86 10.16,21.59 13.97,21.59 24.26,11.3 24.26,7.24 25.02,6.48 25.78,6.48 26.1,6.8 SJ8.2
VDDIO  (via drill 0.51)
  Top 0.203: U3.41 26.82,15.09 19.05,22.86 v19.05,30.48 | U2.8 13.11,49.53 | U2.1 14.88,41.91 13.11,43.69 13.11,49.53 | 13.11,49.53 13.11,52.07 | 13.11,52.07 v13.11,55.37 | 13.11,52.07 17.78,52.07 19.05,50.8 C10.1 19.9,49.11 v20.32,49.53
  Bottom 0.203: v13.11,55.37 13.11,63.09 10.16,66.04 6.35,66.04 JP6.3 | v19.05,30.48 19.05,48.26 v20.32,49.53
VRAW
  Top 0.457: 38.94,38.05 U1.2 38.94,34.72 39.37,34.29 R1.1
  Top 0.508: JP3.VIN 49.2,38.43 C1.2 46.66,38.43 45.72,39.37 39.37,39.37 38.94,38.94 38.94,38.05
VSIM  (via drill 0.51)
  Top 0.203: JP4.C1 20.32,68.58 17.78,66.04 JP4.C6 8.26,66.04 7.83,66.46 C5.1 | C4.1 C5.1 | U3.14 8.89,38.46 v8.89,36.45 | C5.1 6.35,65.28 v6.86,64.77 6.35,64.26 R6.2
  Bottom 0.203: v6.86,64.77 6.86,57.53 8.26,56.13 8.26,50.16 8.89,49.53 v8.89,36.45

### Text on the board
Bottom: v11
tPlace: RTC / Batt | 0/ / HW_TX | A5 | MG2639 / Cellular Shield | 1/ / HW_RX | A4 | 2/ / SW_TX | A3 | 3/ / SW_RX | A2 | 4 | A1 | RSSI | GPS | POWER | 5 | A0 | 6 | VIN | 7/ / PWR | GND | 8/ / GTX | GND | 9/ / GRX | 5V | 10 | 3.3V | 11 | RST | 12 | IOREF | 13 | GND | BATT | AREF | RESET | - | SDA | + | SCL | 3.4-4.2V | BOOT | GND | EAR_SPK | SPK+ | SPK- | EAR_MIC | MIC+ | MIC- | GRN | TXO | RXI | VCC / IO | GND / BLK | TX2 | RX2 | D- | D+ | GND
bPlace: GPIO1/SCL | GPIO/2SDA | 2.8V | GND | RST | HW/0 | 5V | RX | VDDIO | SW/2 | 3.3V | HW/1 | TX | 3.8V | SJ4 | SW/3 | VGPS | HW/1 | GPS_TX | SW/8 | MG2639 / Cellular Shield | HW/0 | GPS_RX | SW/9 | 3.8V | VBAT | SJ2 | SJ3 | VBAT_EN | D6 | BOOT | Connects FTDI / VCC to VCC-IO | 5V | SJ8
tValues: N. Seidle
tDocu: Nathan Seidle / Jim Lindblom